# Altium schematic sheet Power Supply.SchDoc
size A4; SheetNumber: 2; SheetTotal: 5
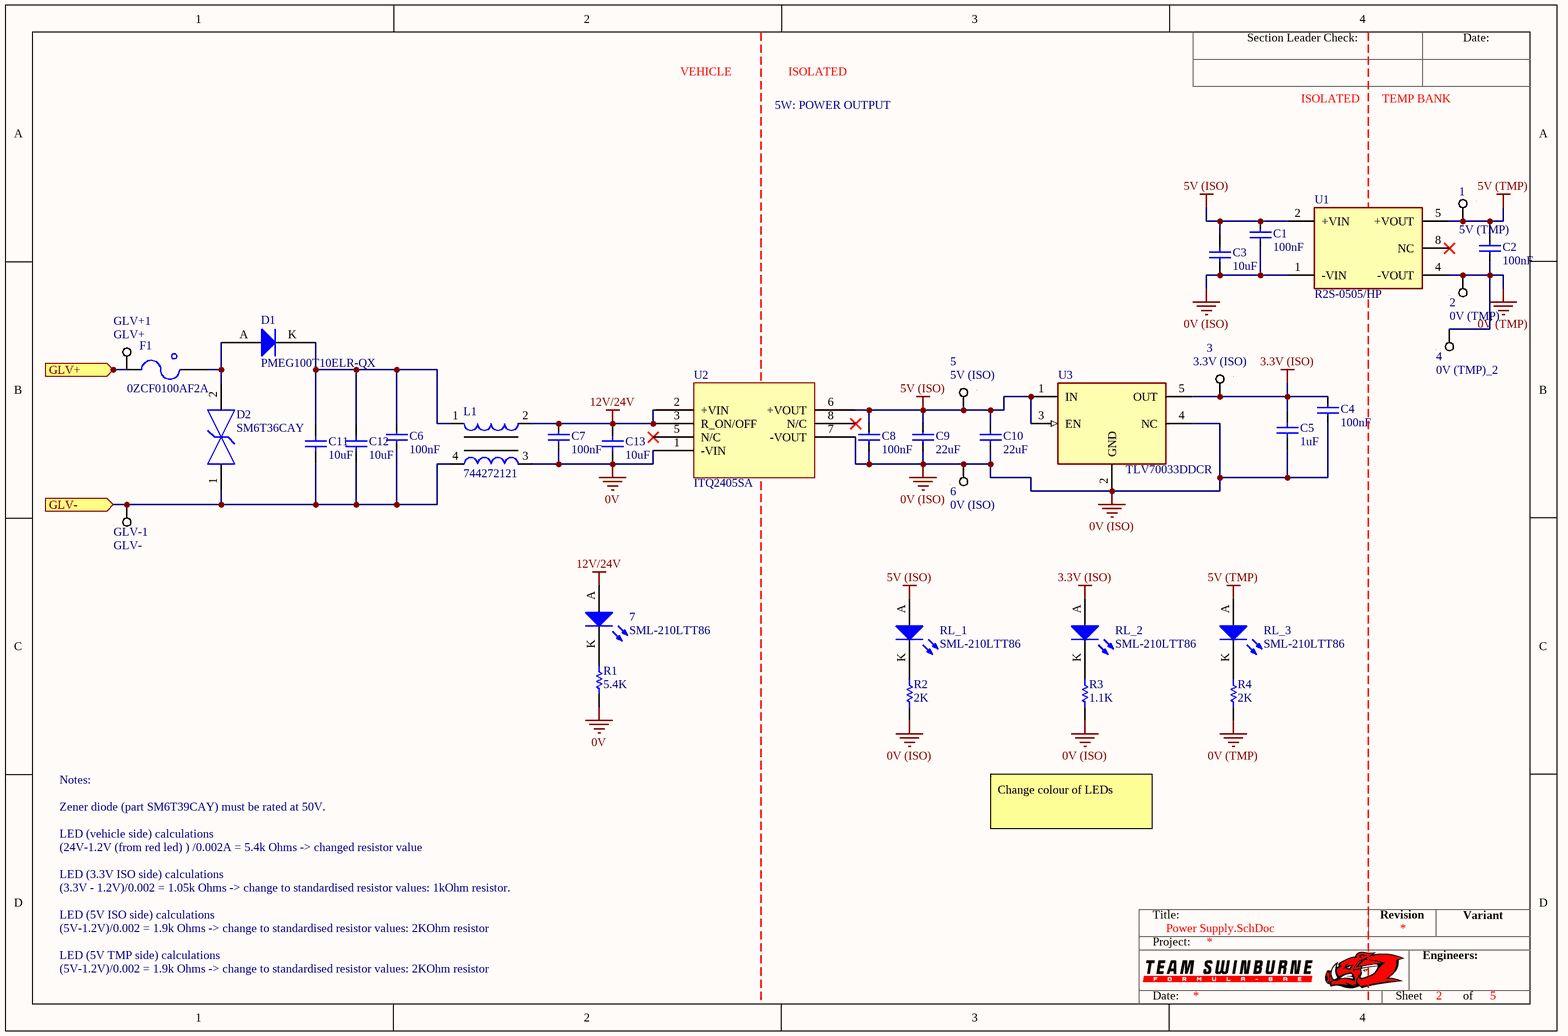
[diagram p0: Power Supply.SchDoc]

## Parts
1  5V (TMP)  [SMD Test Point 1mm]
2  0V (TMP)  [SMD Test Point 1mm]
3  3.3V (ISO)  [SMD Test Point 1mm]
4  0V (TMP)_2
5  5V (ISO)  [SMD Test Point 1mm]
6  0V (ISO)  [SMD Test Point 1mm]
7  SML-210LTT86  [0805 LED]
C1  100nF  [0805]
C2  100nF  [0805]
C3  10uF  [0805]
C4  100nF  [0805]
C5  1uF  [0805]
C6  100nF  [0805]
C7  100nF  [0805]
C8  100nF  [0805]
C9  22uF  [C0805C226M9PAC7210-Footprint-1]
C10  22uF  [C0805C226M9PAC7210-Footprint-1]
C11  10uF  [CAPC2013X145X50NL20T25]
C12  10uF  [CAPC2013X145X50NL20T25]
C13  10uF  [CAPC2013X145X50NL20T25]
D1  PMEG100T10ELR-QX  [SODFL350X110-2N]
D2  SM6T36CAY  [FP-SMB-CA-MFG]
F1  0ZCF0100AF2A  [2920]
GLV+1  GLV+  [SMD Test Point 1mm]
GLV-1  GLV-  [SMD Test Point 1mm]
L1  744272121  [WE-SL5]
R1  5.4K  [RNCF0805BKY5K40-Footprint-1]
R2  2K  [0805]
R3  1.1K  [RESC0603]
R4  2K  [0805]
RL_1  SML-210LTT86  [0805 LED]
RL_2  SML-210LTT86  [0805 LED]
RL_3  SML-210LTT86  [0805 LED]
U1  R2S-0505/HP  [R2S-0505_HP-Footprint-1]
U2  ITQ2405SA  [ITQ2405SA-Footprint-1]
U3  TLV70033DDCR  [FP-DDC0005A-IPC_B]

## Ports
GLV+ (in), GLV- (in)

## Nets
0V: C7.2 C13.1 L1.3 R1.1 U2.1(-VIN)
0V (ISO): 6.1 C1.2 C3.1 C4.2 C5.1 C8.2 C9.1 C10.1 R2.1 R3.1 U1.1(-VIN) U2.7(-VOUT) U3.2(GND) U3.4(NC)
0V (TMP): 2.1 4.1 C2.2 R4.1 U1.4(-VOUT)
3.3V (ISO): 3.1 C4.1 C5.2 RL_2.A U3.5(OUT)
5V (ISO): 5.1 C1.1 C3.2 C8.1 C9.2 C10.2 RL_1.A U1.2(+VIN) U2.6(+VOUT) U3.1(IN) U3.3(EN)
5V (TMP): 1.1 C2.1 RL_3.A U1.5(+VOUT)
12V/24V: 7.A C7.1 C13.2 L1.2 U2.2(+VIN) U2.3(R_ON/OFF)
GLV+: F1.1 GLV+1.1 ; port GLV+
GLV-: C6.2 C11.1 C12.1 D2.1 GLV-1.1 L1.4 ; port GLV-
Net7_K: 7.K R1.2
NetC6_1: C6.1 C11.2 C12.2 D1.K L1.1
NetD1_A: D1.A D2.2 F1.2
NetR2_2: R2.2 RL_1.K
NetR3_2: R3.2 RL_2.K
NetR4_2: R4.2 RL_3.K

Not connected (* = marked no-connect by the designer): U1 8(NC)*; U2 5(N/C)* 8(N/C)*

## Notes on the sheet
- VEHICLE
- 5W: POWER OUTPUT
- ISOLATED
- TEMP BANK
- Notes:
- (24V-1.2V (from red led) ) /0.002A = 5.4k Ohms -> changed resistor value
- LED (vehicle side) calculations
- Zener diode (part SM6T39CAY) must be rated at 50V.
- Change colour of LEDs
- LED (3.3V ISO side) calculations
- (3.3V - 1.2V)/0.002 = 1.05k Ohms -> change to standardised resistor values: 1kOhm resistor.
- LED (5V ISO side) calculations
- (5V-1.2V)/0.002 = 1.9k Ohms -> change to standardised resistor values: 2KOhm resistor
- LED (5V TMP side) calculations
- Section Leader Check:
- Date:
- Title:
- Revision
- Variant
- Project:
- Engineers:
- Sheet
- of

## Library data of the parts
1-3 5 6 GLV+1 GLV-1 = SMD Test Point Small: Positions: 1; Pitch: 0mm; Row Spacing: 0; Flange: No; Contact: NA; Part Number: SMD Test Point Small; Angle: 0
4 = CMP-061-000001-1: Design Item ID: Test Point Small; Source: Generic.SchLib
7 RL_1-RL_3 = CMP-025-000006-1: Red LED Indication - Discrete 1.75V 0805 (2012 Metric); Part Number: SML-210LTT86
C1 C2 C4 C6-C8 = CMP-00018-1: Cap Ceramic 0.1uF 25V X7R 10% Pad SMD 0805 125C Automotive T/R; Max Operating Temperature: 125°C; RoHS Compliant: Yes; Series: GCM; Case Code (Metric): 2012; Thickness: 0.055inch; Depth: 1.25mm; Width: 1.25mm; Package Quantity: 3000; Case Code (Imperial): 0805; Voltage Rating (DC): 25V; Dielectric: X7R; Construction: Flat; Height: 1.25mm; Ratings: AEC-Q200; Mount: Surface Mount; Voltage Rating: 25V; Tolerance: 10%; Length: 2mm; Case/Package: 0805; Packaging: Tape and Reel; Min Operating Temperature: -55°C; Radiation Hardening: No; Capacitance: 100nF; Termination: SMD/SMT
C3 = GRM21BR6YA106KE43L: Manufacturer: muRata; Tolerance: 10%; Material: X5R; Rated Voltage: 50V; Part Number: GRM21BR6YA106KE43L; Value: 10uF; Digikey Part Number: 490-10514-6-ND
C5 = AC0805KKX7R8BB105: Manufacturer: YAGEO; Tolerance: 10%; Material: X7R; Rated Voltage: 25V; Part Number: AC0805KKX7R8BB105; Value: 1uF; Digikey Part Number: DO NOT USE FOR NEW DESIGNS
C9 C10 = CMP-CAP-0012-1: Cap Ceramic 22uF 6.3V X5R 20% Pad SMD 0805 85C T/R; Length: 2mm; Tolerance: 20%; Depth: 1.25mm; ComponentLink1URL: https://www.digikey.com.au/en/products/detail/kemet/C0805C226M9PAC7210/12701503?utm_adgroup=Ceramic%20Capacitors&utm_source=google&utm_medium=cpc&utm_campaign=Shopping_Product_Capacitors&utm_term=&productid=12701503&utm_id=go_cmp-1056236628_adg-53401090298_ad-250137101738_pla-354083418645_dev-c_ext-_prd-12701503_sig-CjwKCAjwnZaVBhA6EiwAVVyv9KTEcqdxbqdQeMdm15seaf-EwUH-KMZCmj15MsoZE7WO92Q0RAY2FRoCkrcQAvD_BwE&gclid=CjwKCAjwnZaVBhA6EiwAVVyv9KTEcqdxbqdQeMdm15seaf-EwUH-KMZCmj15MsoZE7WO92Q0RAY2FRoCkrcQAvD_BwE; Min Operating Temperature: -55°C; RoHS Compliant: Yes; Packaging: Tape and Reel; Dielectric: X5R; Capacitance: 22uF; ComponentLink1Description: Digikey Link; Max Operating Temperature: 85°C; Case/Package: 0805
C11-C13 = CMP-CAP-0009-1: CAP CER 10UF 10V Y5V 0805; Dissipation Factor: 20%; Tolerance: 80%; Dielectric Material: Ceramic; Lead Free: Lead Free; Construction: Flat; Number of Pins: 2; Package Quantity: 1; Max Operating Temperature: 85°C; Resistor Type: Ceramic; Dielectric: Y5V; Capacitance: 10uF; Width: 0.049inch; REACH SVHC: No SVHC; Length: 2mm; Mount: Surface Mount; Case Code (Imperial): 0805; Case/Package: 0805; Termination: SMD/SMT; RoHS Compliant: Yes; Series: CC; Voltage Rating: 10V; Packaging: Tape and Reel; Depth: 1.25mm; Voltage Rating (DC): 10V; Height: 0.85mm; Thickness: 0.049inch; Case Code (Metric): 2012; Halogen Free: Halogen Free; Radiation Hardening: No; Min Operating Temperature: -30°C
D1 = CMP-004-00005-4: Diode 100 V 1A Surface Mount SOD-123W
D2 = CMP-004-00004-1: ESD Suppressors / TVS Diodes 600 W 4kW Transil 6V to 70V Bi; Number of Bidirectional Channels: 1; Leakage Current: 200nA; Peak Pulse Power: 600W; Test Current: 1mA; Clamping Voltage: 49.9V; Direction: Bidirectional; Operating Supply Voltage: 30V; Peak Pulse Current: 62A; Max Breakdown Voltage: 37.8V; Breakdown Voltage: 36V; Max Surge Current: 12A; Min Breakdown Voltage: 34.2V; Power Line Protection: No; Diode Type: ZENER; Reverse Standoff Voltage: 30.8V; Lead Free: Contains Lead; Mounting Technology: Surface Mount; Termination: SMD/SMT; Series: Automotive, AEC-Q101, SM6TY, TRANSIL™; Height: 2.45mm; Min Operating Temperature: -55°C; Reach SVHC Compliant: No; Max Power Dissipation: 600W; Case/Package: DO-214AA; Max Reverse Leakage Current: 200nA; Polarity: Bidirectional; Number of Elements: 1; Package Quantity: 1; RoHS Compliant: Yes; Packaging: Tape and Reel; Max Operating Temperature: 150°C; Width: 3.95mm; Reverse Breakdown Voltage: 34.2V; Number of Channels: 1; Length: 4.6mm; Pins: 2
F1 = CMP-018-000004-1: PTC RESET FUSE 60V 1A 292; Part Number: 0ZCF0100AF2A
L1 = CMP-00010-1: CMC 120UH 2.5A 2LN 460 OHM SMD; Voltage Rating (DC): 80V; Inductance Tolerance: 40%; Max Current Rating: 3A; Number of Lines: 2; Test Frequency: 100kHz; Resistance: 25mR; Core Material: Ferrite; Impedance: 460R; Max Operating Temperature: 125°C; Depth: 8.7mm; Min Operating Temperature: -40°C; Current Rating: 2.5A; Tolerance: 40%; Number of Pins: 4; Case/Package: SMD/SMT; Weight: 0.026103oz; Inductance: 120uH; Package Quantity: 1; Current: 2.5A; Width: 0.343inch; RoHS Compliant: Yes; Length: 0.394inch; DC Resistance (DCR): 25mR; Mount: Surface Mount; Termination: SMD/SMT; Packaging: Tape and Reel; Lead Free: Lead Free; Self Resonant Frequency: 100kHz; Height: 6.5mm; Series: WE-SL5; Max DC Current: 2.5A; Voltage Rating: 80V; REACH SVHC: No SVHC
R1 = CMP-RES-0158-2: RES SMD 5.4K OHM 0.125W 0805; Temperature Coefficient: 5ppm/°C; Max Power Dissipation: 125mW; Tolerance: 0.1%; Resistance: 5.4kR; Power Rating: 100mW; Series: RNCF; Packaging: Tape and Reel; RoHS Compliant: Yes; Min Operating Temperature: -55°C; Features: Automotive AEC-Q200; Mount: Surface Mount; Case/Package: 0805; Number of Terminations: 2; Max Operating Temperature: 155°C
R2 R4 = CMP-037-000309-3: RC0805FR072KL; Tolerance: 0.01; Rated Voltage: 0.125W; Value: 2k; Digikey Part Number: 311-2.00KCRCT-ND; Material: FR-07
R3 = CMP-RES-0079-1: RES SMD 1.1K OHM JUMPER 1/10W 0603; Voltage Rating: 50V; Tolerance: 1%; Power Rating: 100mW; Max Operating Temperature: 155°C; Case/Package: 0603; Min Operating Temperature: -55°C
U1 = CMP-00025-2: DC-DC Unregulated Power Supply Module, 1 Output, 2W, Hybrid; Max Output Voltage: 5.25V; Min Input Voltage: 4.5V; Qualification Status: Not Qualified; Number of Functions: 1; Max Input Voltage: 5.5V; Nominal Output Voltage: 5V; Trim/Adjustable Output: No; Max Output Current: 400mA; Min Output Voltage: 4.75V; Load Regulation-Max: 15%; Terminal Position: DUAL; Width: 10.7mm; Number of Pins: 5; Package Shape: Rectangular; Max Operating Temperature: 100°C; Package Style: MICROELECTRONIC ASSEMBLYMeter; RoHS Compliant: Yes; Package Code: SOP; Height - Seated (Max): 9.5mm; Analog IC - Other Type: DC-DC UNREGULATED POWER SUPPLY MODULE; Temperature Grade: INDUSTRIAL; Terminal Form: Flat; Reach SVHC Compliant: Yes; Min Operating Temperature: -40°C; Length: 12.75mm; Max Output Power: 2W; Number of Outputs: 1; Surface Mount: Yes; Terminal Pitch: 2.54mm; Nominal Input Voltage: 5V; Technology: HYBRID
U2 = CMP-001-0010-2: Dc-dc Converter, 6W Single O/p, 4: 1 Input Sip; Max Output current: 1.2A; Min Input Voltage (DC): 9V; Voltage - Output 1: 5V; Max Supply Voltage: 36V; Isolation Voltage: 1.5kV; Number of Outputs: 1; Efficiency: 84%; Reach SVHC Compliant: Unknown; Current - Output 1: 1.2A; Min Operating Temperature: -40°C; Packaging: Rail/Tube; Features: SCP; RoHS Compliant: Yes; Max Power Dissipation: 6W; Width: 0.36inch; Mounting Technology: Through Hole,PCB; Case/Package: SIP; Output Power: 6W; Max Operating Temperature: 100°C; Max Output Power: 6W; Height: 0.44inch; Max Input Voltage (DC): 36V; Length: 0.86inch; Series: ITQ; Min Input Voltage: 9V; Depth: 21.85mm
U3 = CMP-001-0011-2: Fixed Positive LDO Regulator, 3.3V, 0.25V Dropout, PMOS, PDSO5; Dropout Voltage1-Nom: 175mV; Input Voltage Absolute-Max: 6V; Package Equivalence Code: TSOP5/6,.11,37; Package Body Material: Plastic; Voltage Tolerance-Max: 2%; Max Supply Voltage: 5.5V; Channels: 1; Dropout Voltage1-Max: 250mV; Regulator Type: FIXED POSITIVE SINGLE OUTPUT LDO REGULATOR; Output Current1-Max: 200mA; Min Input Voltage: 2V; Output Voltage1-Min: 3.234V; Load Regulation-Max: 0.015%; Line Regulation-Max: 0.005%; Output Voltage1-Max: 3.366V; Qualification Status: Not Qualified; Reach SVHC Compliant: Yes; JESD-30 Code: R-PDSO-G5; Terminal Position: DUAL; Pins: 5; Moisture Sensitivity Level: 2; Length: 2.9mm; Operating Temperature, TJ-Min: -40°C; Operating Temperature, TJ-Max: 125°C; Package Shape: Rectangular; Output Voltage1-Nom: 3.3V; Packaging: Tape and Reel; Surface Mount: Yes; Number of Outputs: 1; JESD-609 Code: e4; Adjustability: FIXED; Technology: PMOS; Peak Reflow Temperature (Cel): 260°C; Terminal Form: Gull Wing; Case/Package: TSSOP; Height - Seated (Max): 1.1mm; Package Style: SMALL OUTLINE, THIN PROFILE, SHRINK PITCHMeter; Terminal Finish: Nickel; RoHS Compliant: Yes; Terminal Pitch: 0.95mm; Width: 1.6mm